# Altium schematic sheet PAGE3-LED_Drivers.SchDoc
size 513 x 386 mm
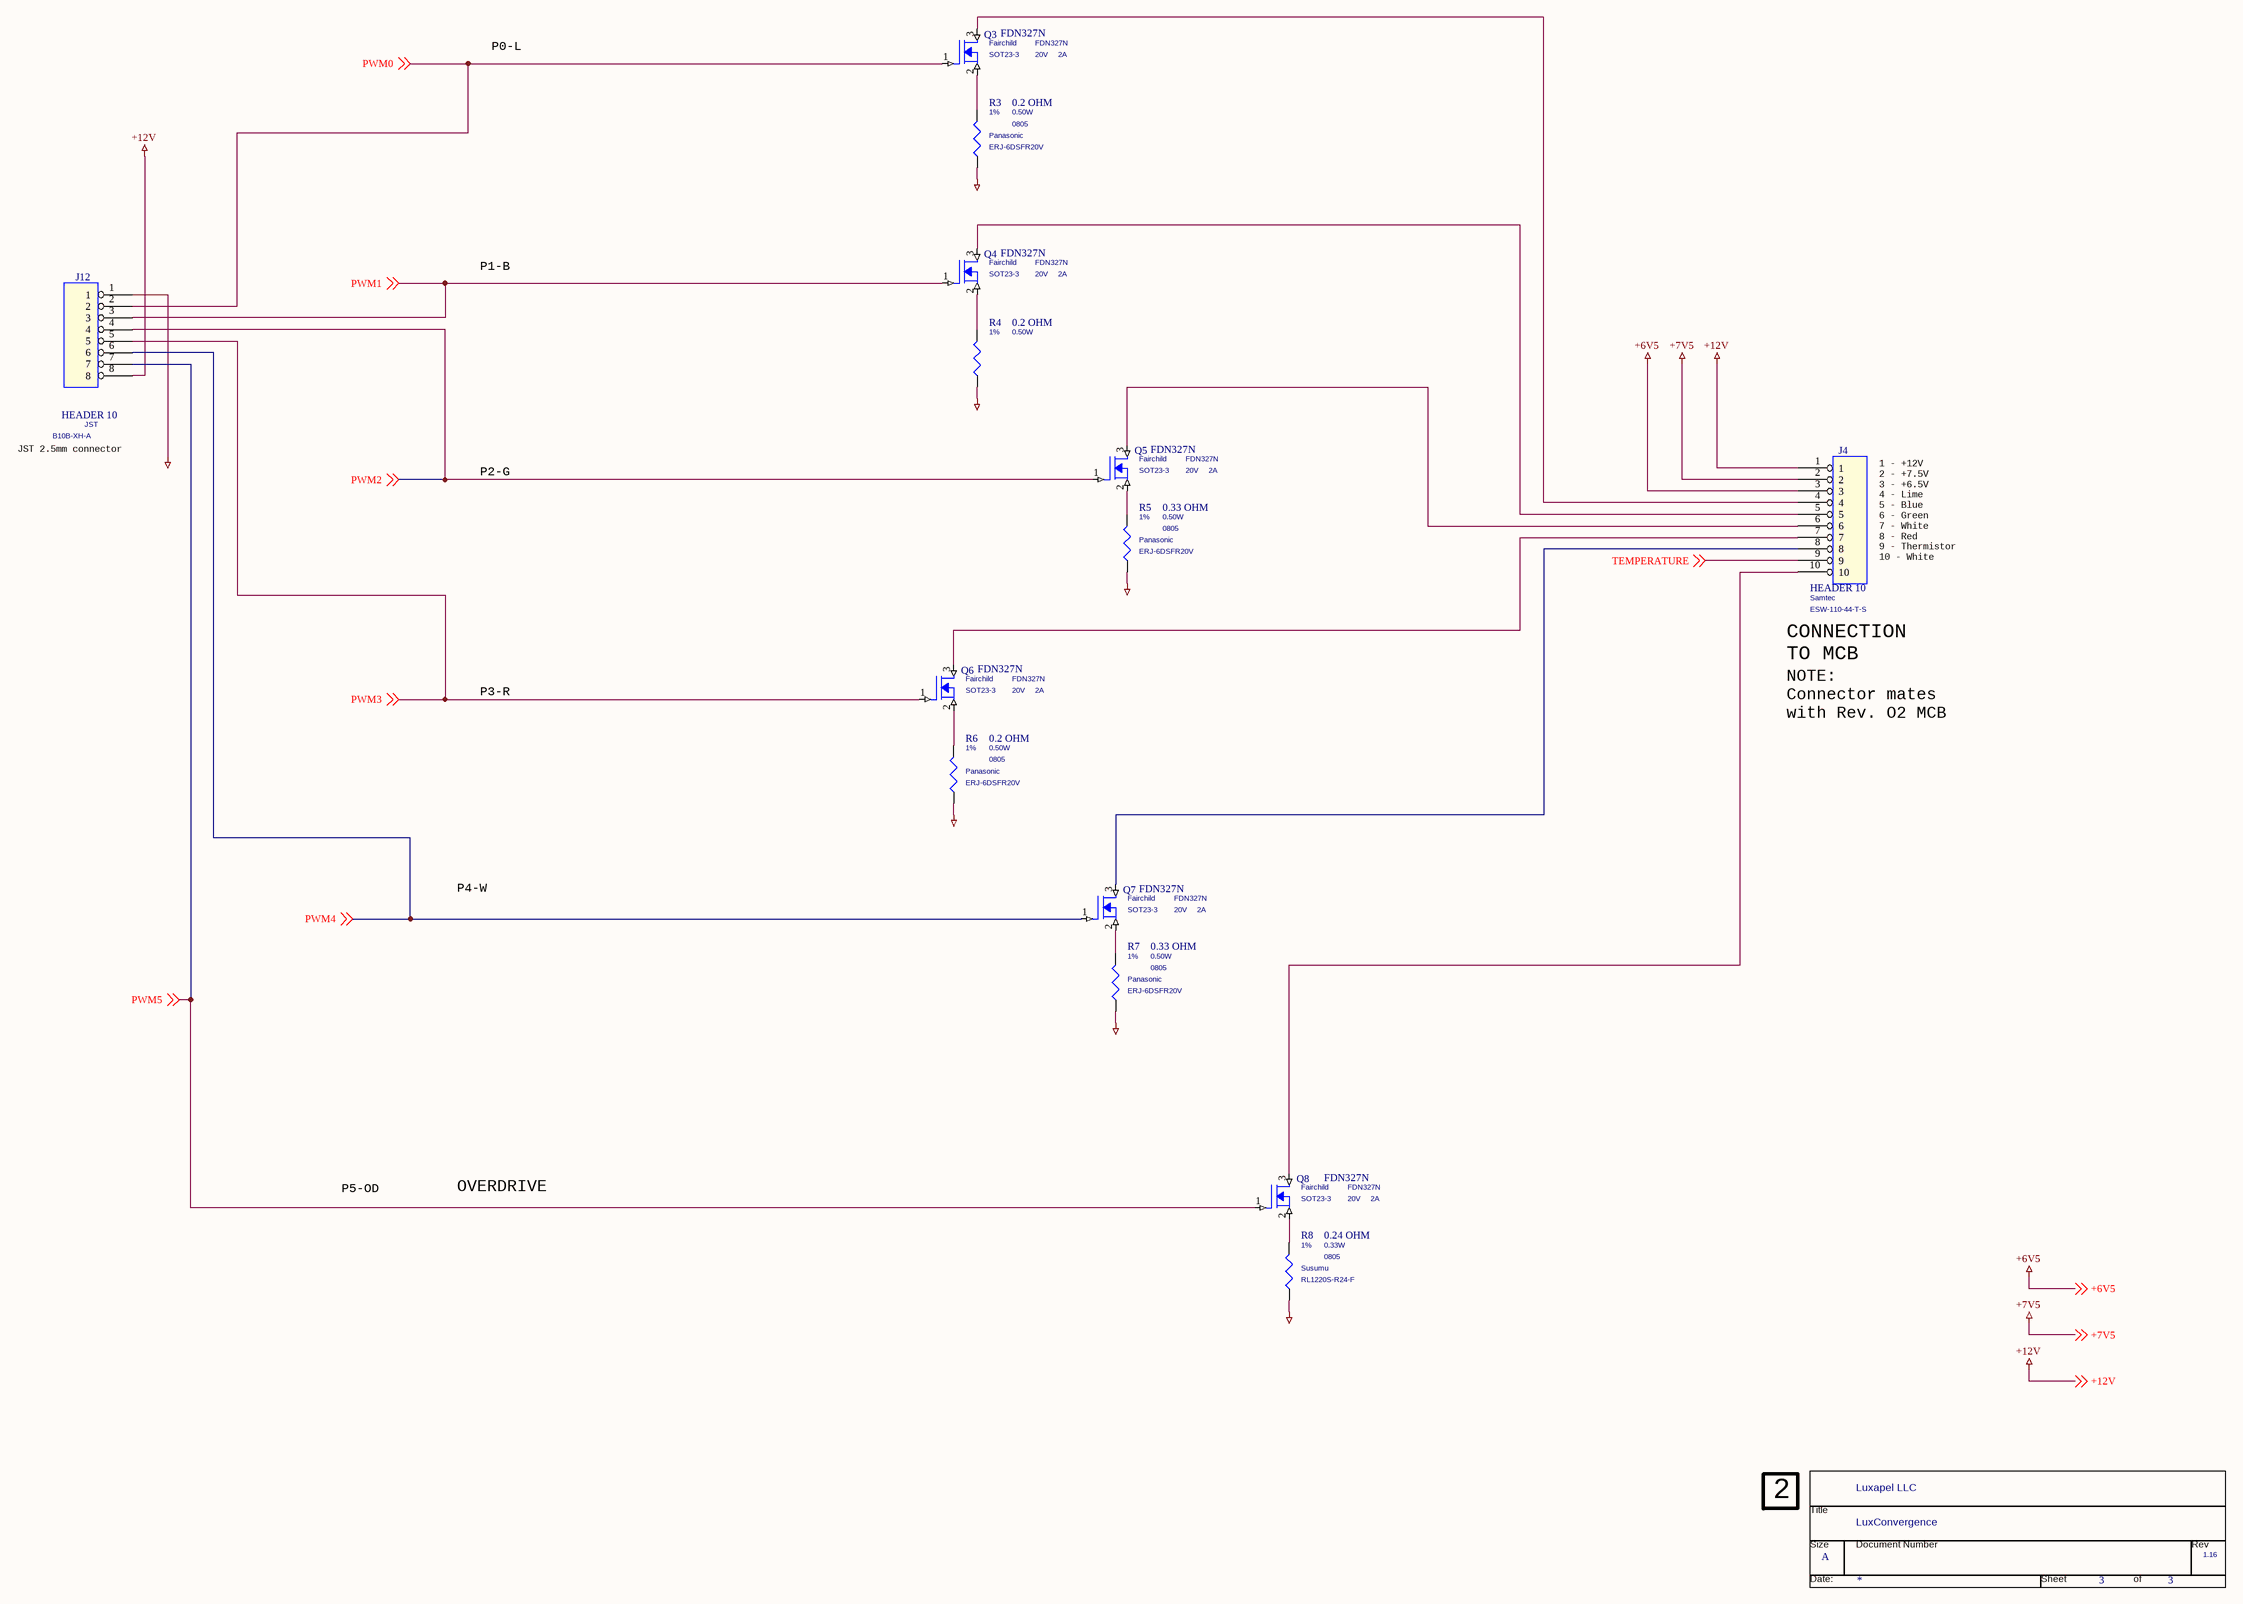
[diagram p0: PAGE3-LED_Drivers.SchDoc]

## Parts
*  RevCode: 1.16  Title: LuxConvergence  OrgName: Luxapel LLC  Page Size: A  Page Number: 3  (hidden comment: TitleBlock1)  (graphical)
J4  HEADER 10  Mfg: Samtec  P/N: ESW-110-44-T-S  [SIP-10]
J12  HEADER 10  Mfg: JST  P/N: B10B-XH-A  [SIP-10]
Q3  FDN327N  Voltage: 20V  Power: 2A  Mfg: Fairchild  [SOT23-3]
Q4  FDN327N  Voltage: 20V  Power: 2A  Mfg: Fairchild  [SOT23-3]
Q5  FDN327N  Mfg: Fairchild  Power: 2A  Voltage: 20V  [SOT23-3]
Q6  FDN327N  Mfg: Fairchild  Power: 2A  Voltage: 20V  [SOT23-3]
Q7  FDN327N  Mfg: Fairchild  Power: 2A  Voltage: 20V  PCB Footprint: SOT23-3  [SOT23-323]
Q8  FDN327N  Voltage: 20V  Power: 2A  Mfg: Fairchild  [SOT23-3]
R3  0.2 OHM  Mfg: Panasonic  P/N: ERJ-6DSFR20V  Precision: 1%  Power: 0.50W  [0805]
R4  0.2 OHM  Precision: 1%  Power: 0.50W  [1210]
R5  0.33 OHM  Mfg: Panasonic  P/N: ERJ-6DSFR20V  Precision: 1%  Power: 0.50W  PCB Footprint: 0805  [_0805]
R6  0.2 OHM  Mfg: Panasonic  P/N: ERJ-6DSFR20V  Precision: 1%  Power: 0.50W  [0805]
R7  0.33 OHM  Mfg: Panasonic  P/N: ERJ-6DSFR20V  Precision: 1%  Power: 0.50W  PCB Footprint: 0805  [_0805]
R8  0.24 OHM  Mfg: Susumu  P/N: RL1220S-R24-F  Precision: 1%  Power: 0.33W  [0805]

## Nets
+6V5: J4.3 ; off-sheet +6V5
+7V5: J4.2 ; off-sheet +7V5
+12V: J4.1 J12.8 ; off-sheet +12V
GND_POWER.global: J12.1 R3.1 R4.1 R5.1 R6.1 R7.1 R8.1
PWM0: J12.2 Q3.1(GATE) ; off-sheet PWM0
PWM1: J12.3 Q4.1(GATE) ; off-sheet PWM1
PWM2: J12.4 Q5.1(GATE) ; off-sheet PWM2
PWM3: J12.5 Q6.1(GATE) ; off-sheet PWM3
PWM4: J12.6 Q7.1(GATE) ; off-sheet PWM4
PWM5: J12.7 Q8.1(GATE) ; off-sheet PWM5
TEMPERATURE: J4.9 ; off-sheet TEMPERATURE
NetJ4_4: J4.4 Q3.3(DRAIN)
NetJ4_5: J4.5 Q4.3(DRAIN)
NetJ4_6: J4.6 Q5.3(DRAIN)
NetJ4_7: J4.7 Q6.3(DRAIN)
NetJ4_8: J4.8 Q7.3(DRAIN)
NetJ4_10: J4.10 Q8.3(DRAIN)
NetQ3_2: Q3.2(SOURCE) R3.2
NetQ4_2: Q4.2(SOURCE) R4.2
NetQ5_2: Q5.2(SOURCE) R5.2
NetQ6_2: Q6.2(SOURCE) R6.2
NetQ7_2: Q7.2(SOURCE) R7.2
NetQ8_2: Q8.2(SOURCE) R8.2

## Notes on the sheet
- P0-L
- P1-B
- JST 2.5mm connector
- P2-G
- 1 - +12V
  2 - +7.5V
  3 - +6.5V
  4 - Lime
  5 - Blue
  6 - Green
  7 - White
  8 - Red
  9 - Thermistor
  10 - White Alternate
- P3-R
- CONNECTION
  TO MCB
- NOTE:
  Connector mates
  with Rev. O2 MCB
- P4-W
- P5-OD
- OVERDRIVE
- (near *) 2
- (in symbol TitleBlock1) Title; Size; Document Number; Rev; Date:; Sheet; of

## Library data of the parts
* = TitleBlock1: Doc: LuxConvergence_1_0; Page Create Date: March  8, 1995; Page Count: 3; Page Modify Date: *
J12 = HEADER 10_0: PCB Footprint: SIP-10
Q3-Q8 = N DGS_0: P/N: FDN327N
  Q3-Q6 Q8: PCB Footprint: SOT23-3
R3 R5-R8 = RESISTOR: Voltage: ?V
  R3 R6 R8: PCB Footprint: 0805
R4 = RESISTOR: Mfg: Panasonic; P/N: ERJ-6DSFR20V; Voltage: ?V; PCB Footprint: 1210
J4 = HEADER 10: PCB Footprint: SIP-10